# Altium schematic sheet IF_TX.SchDoc: {Наименование}
size 420 x 297 mm; DocumentNumber: ПЛАС.ХХХХХХ.ХХХ ХХ; SheetNumber: {}; SheetTotal: {}; PageSetup: Record=PageOptions|CenterHorizontal=False|CenterVertical=False|PrintScale=0.95|XCorrection=0.00|YCorrection=0.00|PrintKind=1|BorderSize=5000000|LeftOffset=0|BottomOffset=0|Orientation=1|PaperLength=1000|PaperWidth=1000|Scale=100|PaperSource=15|PrintQuality=600|MediaType=1|DitherType=10|PaperKind=A4|PrintScaleMode=1; Rule: PcbType=ProtelPcb
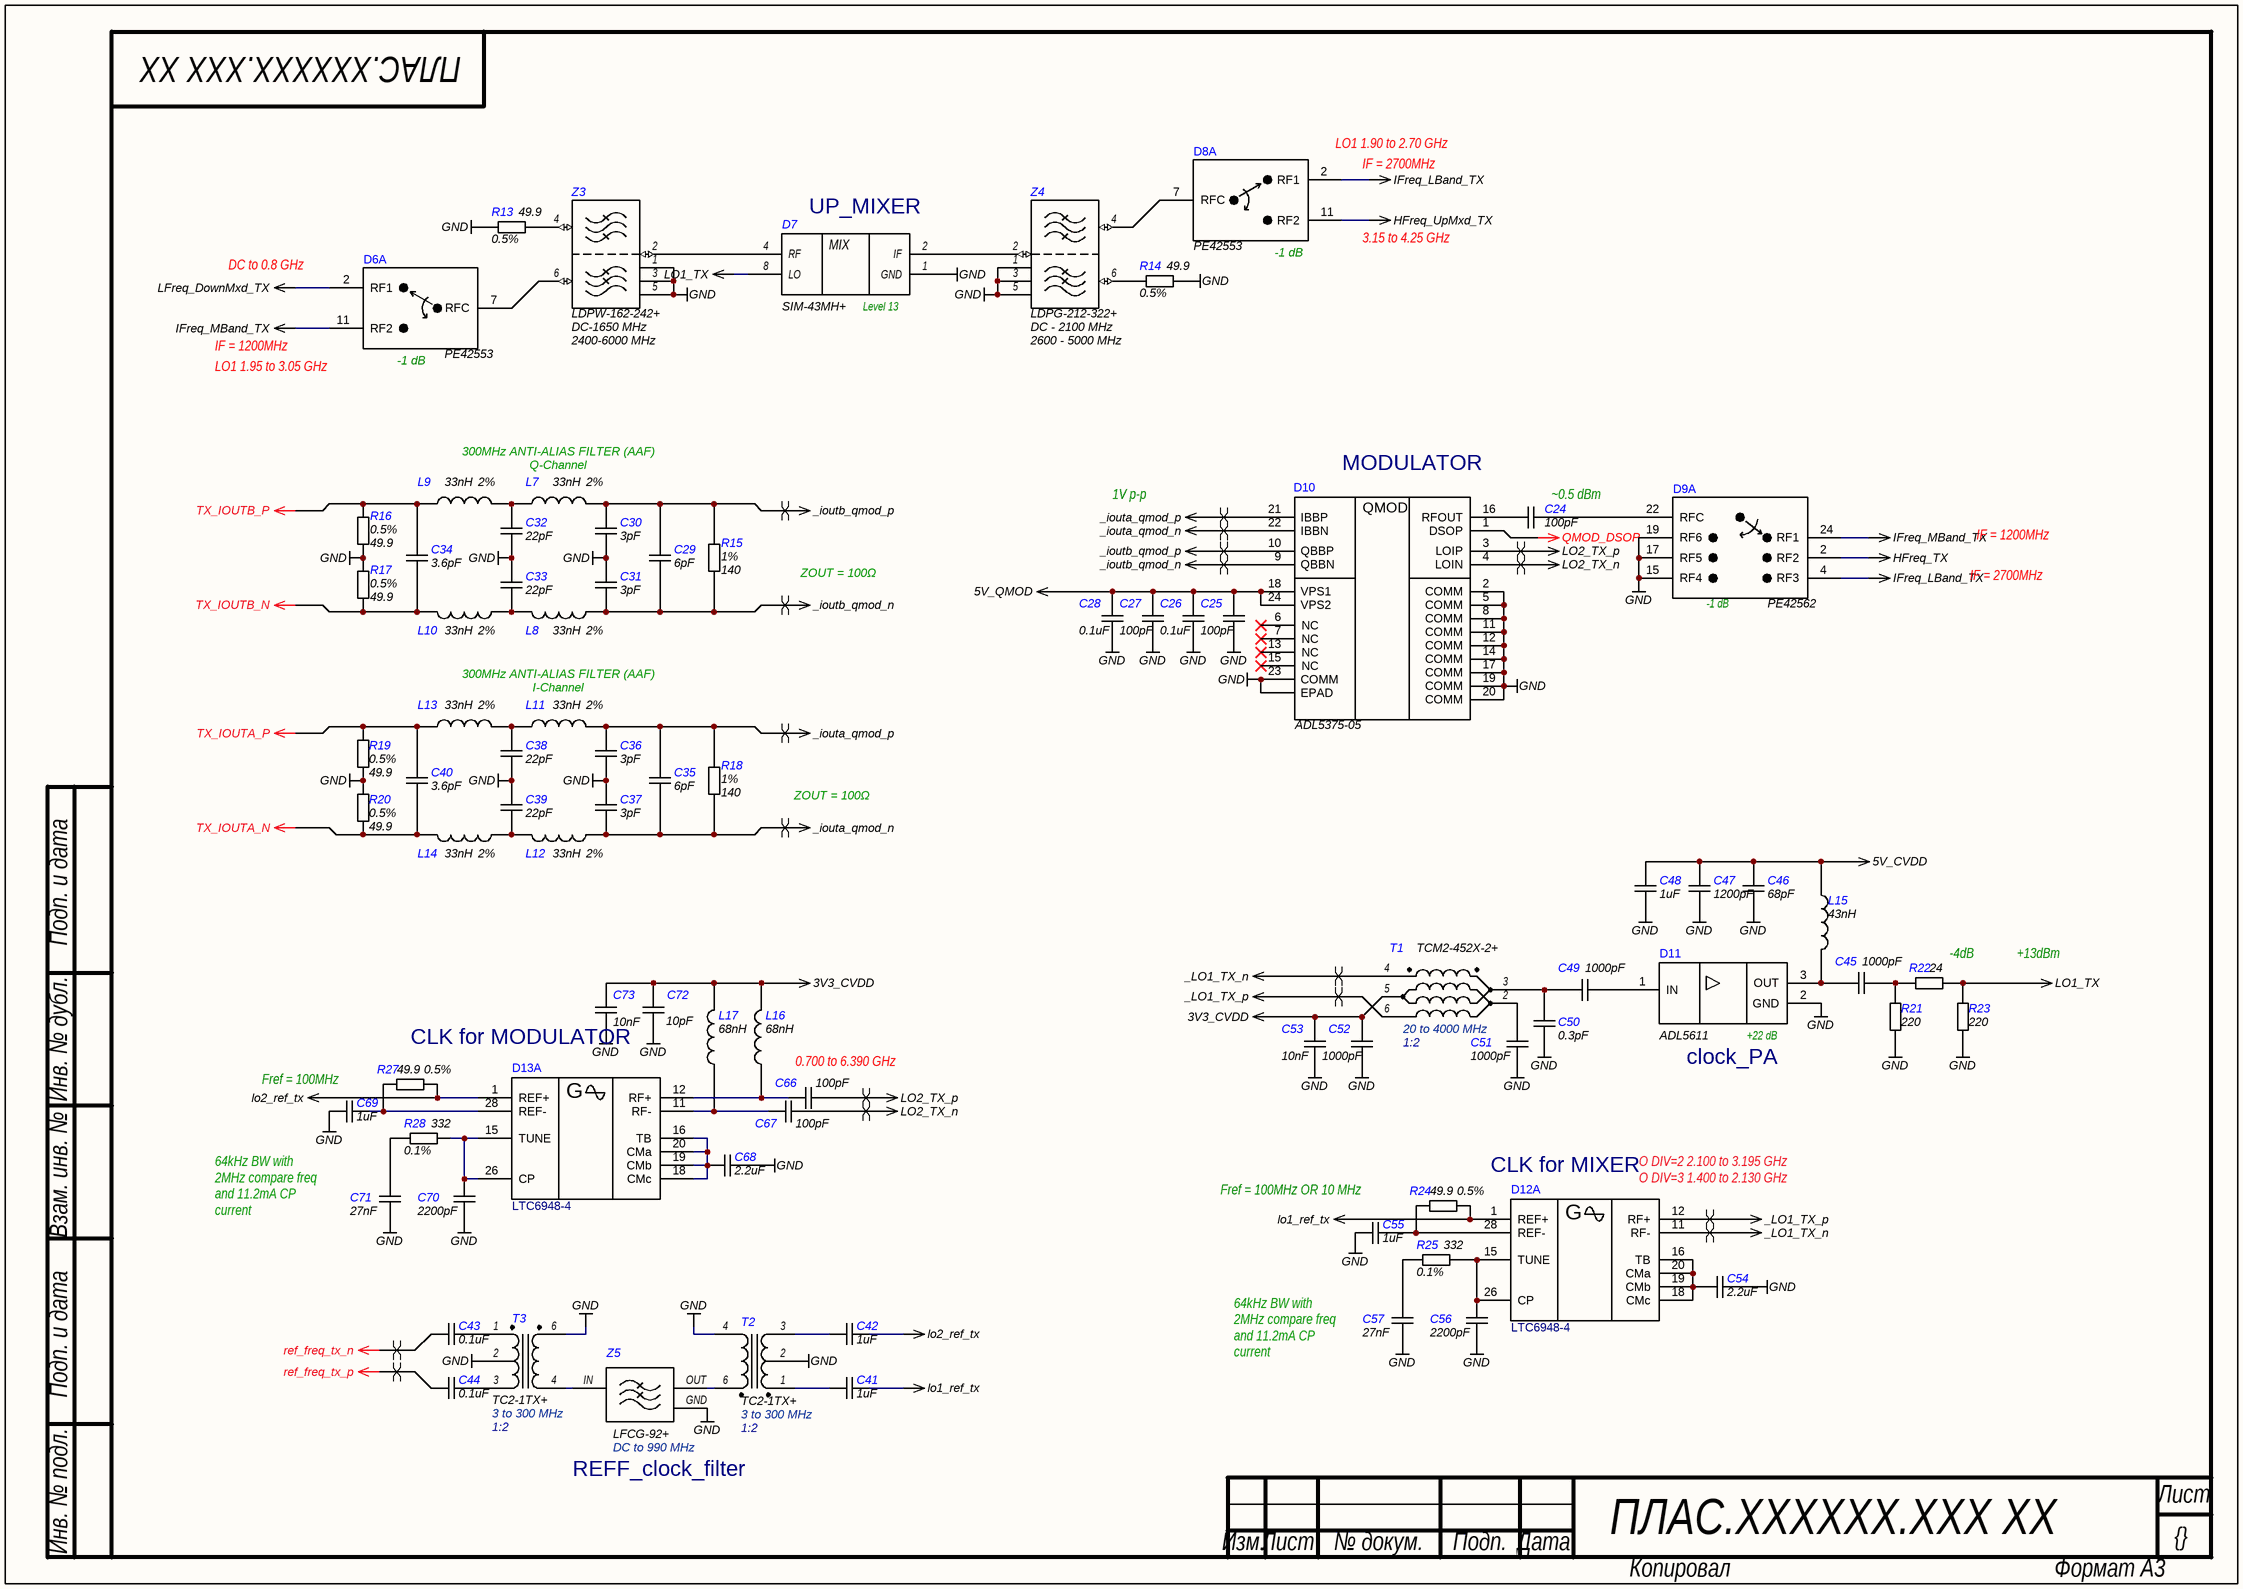
[diagram p0: IF_TX.SchDoc]

## Parts
C24  value 100pF  [C0402]  (hidden comment: CAP)
C25  value 100pF  [C0402]  (hidden comment: CAP)
C26  value 0.1uF  [C0402]  (hidden comment: CAP)
C27  value 100pF  [C0402]  (hidden comment: CAP)
C28  value 0.1uF  [C0402]  (hidden comment: CAP)
C29  value 6pF  [C0402]  (hidden comment: CAP)
C30  value 3pF  [C0402]  (hidden comment: CAP)
C31  value 3pF  [C0402]  (hidden comment: CAP)
C32  value 22pF  [C0402]  (hidden comment: CAP)
C33  value 22pF  [C0402]  (hidden comment: CAP)
C34  value 3.6pF  [C0402]  (hidden comment: CAP)
C35  value 6pF  [C0402]  (hidden comment: CAP)
C36  value 3pF  [C0402]  (hidden comment: CAP)
C37  value 3pF  [C0402]  (hidden comment: CAP)
C38  value 22pF  [C0402]  (hidden comment: CAP)
C39  value 22pF  [C0402]  (hidden comment: CAP)
C40  value 3.6pF  [C0402]  (hidden comment: CAP)
C41  value 1uF  [C0603]  (hidden comment: CAP)
C42  value 1uF  [C0603]  (hidden comment: CAP)
C43  value 0.1uF  [C0402]  (hidden comment: CAP)
C44  value 0.1uF  [C0402]  (hidden comment: CAP)
C45  value 1000pF  [C0402]  (hidden comment: CAP)
C46  value 68pF  [C0402]  (hidden comment: CAP)
C47  value 1200pF  [C0603]  (hidden comment: CAP)
C48  value 1uF  [C0603]  (hidden comment: CAP)
C49  value 1000pF  [C0402]  (hidden comment: CAP)
C50  value 0.3pF  [C0402]  (hidden comment: CAP)
C51  value 1000pF  [C0402]  (hidden comment: CAP)
C52  value 1000pF  [C0402]  (hidden comment: CAP)
C53  value 10nF  [C0402]  (hidden comment: CAP)
C54  value 2.2uF  [C0603]  (hidden comment: CAP)
C55  value 1uF  [C0603]  (hidden comment: CAP)
C56  value 2200pF  [C0603]  (hidden comment: CAP)
C57  value 27nF  [C0603]  (hidden comment: CAP)
C66  value 100pF  [C0402]  (hidden comment: CAP)
C67  value 100pF  [C0402]  (hidden comment: CAP)
C68  value 2.2uF  [C0603]  (hidden comment: CAP)
C69  value 1uF  [C0603]  (hidden comment: CAP)
C70  value 2200pF  [C0603]  (hidden comment: CAP)
C71  value 27nF  [C0603]  (hidden comment: CAP)
C72  value 10pF  [C0402]  (hidden comment: CAP)
C73  value 10nF  [C0402]  (hidden comment: CAP)
D6  PE42553  [QFN-16]  (part A of 2)
D7  SIM-43MH+  [SIM-43MH+]
D8  PE42553  [QFN-16]  (part A of 2)
D9  PE42562  [QFN-24]  (part A of 2)
D10  Name: ADL5375-05  [LFCSP-24]  (hidden comment: ADL5375)
D11  ADL5611  [ADL5610]
D12  LTC6948-4  [QFN-28]  (part A of 2)
D13  LTC6948-4  [QFN-28]  (part A of 2)
L7  value 33nH  Tolerance: 2%  [L0603_HP]  (hidden comment: Inductor RF)
L8  value 33nH  Tolerance: 2%  [L0603_HP]  (hidden comment: Inductor RF)
L9  value 33nH  Tolerance: 2%  [L0603_HP]  (hidden comment: Inductor RF)
L10  value 33nH  Tolerance: 2%  [L0603_HP]  (hidden comment: Inductor RF)
L11  value 33nH  Tolerance: 2%  [L0603_HP]  (hidden comment: Inductor RF)
L12  value 33nH  Tolerance: 2%  [L0603_HP]  (hidden comment: Inductor RF)
L13  value 33nH  Tolerance: 2%  [L0603_HP]  (hidden comment: Inductor RF)
L14  value 33nH  Tolerance: 2%  [L0603_HP]  (hidden comment: Inductor RF)
L15  value 43nH  [L0603_HP]  (hidden comment: Inductor RF)
L16  value 68nH  [L0603_HP]  (hidden comment: Inductor RF)
L17  value 68nH  [L0603_HP]  (hidden comment: Inductor RF)
R13  value 49.9  Tolerance: 0.5%  [R0402]  (hidden comment: RES)
R14  value 49.9  Tolerance: 0.5%  [R0402]  (hidden comment: RES)
R15  value 140  Tolerance: 1%  [R0402]  (hidden comment: RES)
R16  value 49.9  Tolerance: 0.5%  [R0402]  (hidden comment: RES)
R17  value 49.9  Tolerance: 0.5%  [R0402]  (hidden comment: RES)
R18  value 140  Tolerance: 1%  [R0402]  (hidden comment: RES)
R19  value 49.9  Tolerance: 0.5%  [R0402]  (hidden comment: RES)
R20  value 49.9  Tolerance: 0.5%  [R0402]  (hidden comment: RES)
R21  value 220  [R0402]  (hidden comment: RES)
R22  value 24  [R0402]  (hidden comment: RES)
R23  value 220  [R0402]  (hidden comment: RES)
R24  value 49.9  Tolerance: 0.5%  [R0402]  (hidden comment: RES)
R25  value 332  Tolerance: 0.1%  [R0603]  (hidden comment: RES)
R27  value 49.9  Tolerance: 0.5%  [R0402]  (hidden comment: RES)
R28  value 332  Tolerance: 0.1%  [R0603]  (hidden comment: RES)
T1  TCM2-452X-2+  Frequency: 20 to 4000 MHz  Ratio: 1:2  [DB1627]
T2  TC2-1TX+  Frequency: 3 to 300 MHz  Ratio: 1:2  [AT1521]
T3  TC2-1TX+  Frequency: 3 to 300 MHz  Ratio: 1:2  [AT1521]
Z3  LDPW-162-242+  Low Pass: DC-1650 MHz  High Pass: 2400-6000 MHz  [JC0603C]
Z4  LDPG-212-322+  Low Pass: DC - 2100 MHz  High Pass: 2600 - 5000 MHz  [GE0805C-10]
Z5  LFCG-92+  Frequency: DC to 990 MHz  [GE0805C-2]

## Nets
3V3_CVDD: C52.1 C53.2 C72.2 C73.2 L16.2 L17.2 T1.5
5V_CVDD: C46.2 C47.2 C48.1 L15.2
5V_QMOD: C25.2 C26.2 C27.2 C28.2 D10.18(VPS1) D10.24(VPS2)
_iouta_qmod_n: C35.2 C37.2 D10.22(IBBN) L12.2 R18.2
_iouta_qmod_p: C35.1 C36.1 D10.21(IBBP) L11.2 R18.1
_ioutb_qmod_n: C29.2 C31.2 D10.9(QBBN) L8.2 R15.2
_ioutb_qmod_p: C29.1 C30.1 D10.10(QBBP) L7.2 R15.1
_LO1_TX_n: D12.11(RF-) T1.4
_LO1_TX_p: D12.12(RF+) T1.6
GND: C25.1 C26.1 C27.1 C28.1 C30.2 C31.1 C32.2 C33.1 C36.2 C37.1 C38.2 C39.1 C46.1 C47.1 C48.2 C50.1 C51.2 C52.2 C53.1 C54.1 C55.2 C56.1 C57.1 C68.1 C69.2 C70.1 C71.1 C72.1 C73.1 D7.1(GND) D9.15(RF4) D9.17(RF5) D9.19(RF6) D10.2(COMM) D10.5(COMM) D10.8(COMM) D10.11(COMM) D10.12(COMM) D10.14(COMM) D10.17(COMM) D10.19(COMM) D10.20(COMM) D10.23(COMM) D10.25(EPAD) D11.2(GND) R13.1 R14.1 R16.2 R17.1 R19.2 R20.1 R21.2 R23.2 T2.2 T2.4 T3.2 T3.6 Z3.1(GND) Z3.3(GND) Z3.5(GND) Z4.1(GND) Z4.3(GND) Z4.5(GND) Z5.GND
HFreq_TX: D9.2(RF2)
HFreq_UpMxd_TX: D8.11(RF2)
IFreq_LBand_TX: D8.2(RF1) D9.4(RF3)
IFreq_MBand_TX: D6.11(RF2) D9.24(RF1)
LFreq_DownMxd_TX: D6.2(RF1)
lo1_ref_tx: C41.1 D12.1(REF+) R24.1
LO1_TX: D7.8(LO) R22.1 R23.1
lo2_ref_tx: C42.1 D13.1(REF+) R27.1
LO2_TX_n: C67.2 D10.4(LOIN)
LO2_TX_p: C66.2 D10.3(LOIP)
QMOD_DSOP: D10.1(DSOP)
ref_freq_tx_n: C43.2
ref_freq_tx_p: C44.2
TX_IOUTA_N: C40.2 L14.1 R20.2
TX_IOUTA_P: C40.1 L13.1 R19.1
TX_IOUTB_N: C34.2 L10.1 R17.2
TX_IOUTB_P: C34.1 L9.1 R16.1
NetC24_1: C24.1 D10.16(RFOUT)
NetC24_2: C24.2 D9.22(RFC)
NetC32_1: C32.1 L7.1 L9.2
NetC33_2: C33.2 L8.1 L10.2
NetC38_1: C38.1 L11.1 L13.2
NetC39_2: C39.2 L12.1 L14.2
NetC41_2: C41.2 T2.1
NetC42_2: C42.2 T2.3
NetC43_1: C43.1 T3.1
NetC44_1: C44.1 T3.3
NetC45_1: C45.1 D11.3(OUT) L15.1
NetC45_2: C45.2 R21.1 R22.2
NetC49_1: C49.1 C50.2 T1.3
NetC49_2: C49.2 D11.1(IN)
NetC51_1: C51.1 T1.2
NetC54_2: C54.2 D12.16(TB) D12.18(CMc) D12.19(CMb) D12.20(CMa)
NetC55_1: C55.1 D12.28(REF-) R24.2
NetC56_2: C56.2 D12.15(TUNE) D12.26(CP) R25.1
NetC57_2: C57.2 R25.2
NetC66_1: C66.1 D13.12(RF+) L16.1
NetC67_1: C67.1 D13.11(RF-) L17.1
NetC68_2: C68.2 D13.16(TB) D13.18(CMc) D13.19(CMb) D13.20(CMa)
NetC69_1: C69.1 D13.28(REF-) R27.2
NetC70_2: C70.2 D13.15(TUNE) D13.26(CP) R28.1
NetC71_2: C71.2 R28.2
NetD6_7: D6.7(RFC) Z3.6
NetD7_2: D7.2(IF) Z4.2
NetD7_4: D7.4(RF) Z3.2
NetD8_7: D8.7(RFC) Z4.4
NetR13_2: R13.2 Z3.4
NetR14_2: R14.2 Z4.6
NetT2_6: T2.6 Z5.OUT
NetT3_4: T3.4 Z5.IN

Not connected (* = marked no-connect by the designer): D10 6(NC)* 7(NC)* 13(NC)* 15(NC)*

## Layout directives
differential pair: _iouta_qmod_n, _iouta_qmod_p, _ioutb_qmod_n, _ioutb_qmod_p, _LO1_TX_n, _LO1_TX_p, LO2_TX_n, LO2_TX_p, ref_freq_tx_n, ref_freq_tx_p

## Notes on the sheet
- (near D8) LO1 1.90 to 2.70 GHz
- IF = 2700MHz
- (near D7) UP_MIXER
- 3.15 to 4.25 GHz
- (near D6) DC to 0.8 GHz
- IF = 1200MHz
- (near D6) LO1 1.95 to 3.05 GHz
- 300MHz ANTI-ALIAS FILTER (AAF) Q-Channel
- 1V p-p
- (near D10) MODULATOR
- (near C24) ~0.5 dBm
- ZOUT = 100Ω
- 300MHz ANTI-ALIAS FILTER (AAF) I-Channel
- (near R22) -4dB
- +13dBm
- (near C73) CLK for MODULATOR
- 0.700 to 6.390 GHz
- (near D11) clock_PA
- (near C69) Fref = 100MHz
- Fref = 100MHz OR 10 MHz
- CLK for MIXER
- (near D12) O DIV=2 2.100 to 3.195 GHz
  O DIV=3 1.400 to 2.130 GHz
- 64kHz BW with 2MHz compare freq and 11.2mA CP current
- REFF_clock_filter
- Подп. и дата
- Инв. № дубл.
- Взам. инв. №
- Инв. № подл.
- Лист
- Изм.
- № докум.
- Подп.
- Дата
- Копировал
- Формат А3
- (in symbol ADL5375) QMOD
- (in symbol ADL5611) +22 dB
- (in symbol LTC6948, part A) G
- (in symbol PE42553, part A) -1 dB
- (in symbol PE42562, part A) -1 dB
- (in symbol SIM-43MH+) MIX; Level 13

## Library data of the parts
C24 C25 C27 C66 C67 = CAP: SMD Capacitor; Manufacturer: Murata; Material: NP0; Tolerance: 1%; Voltage: 50V; Type: Ceramic Capacitor; P/N: GRM1555C1H101FA01D; Supplier 1: Digi-key; Supplier Part Number 1: 490-8180-1-ND; Supplier 2: Mouser; Supplier Part Number 2: 81-GRM1555C1H101FA1D; Supplier 3: Farnell; Supplier Part Number 3: *
C26 C28 C43 C44 = CAP: SMD Capacitor; Manufacturer: Murata; Material: X7R; Tolerance: 10%; Voltage: 10V; Type: Ceramic Capacitor; P/N: GRM155R71A104KA01J; Supplier 1: Digi-key; Supplier Part Number 1: 490-6322-1-ND; Supplier 2: Mouser; Supplier Part Number 2: 81-GRM155R71A104KA1J; Supplier 3: Farnell; Supplier Part Number 3: *
C29 C35 = CAP: SMD Capacitor; Manufacturer: Murata; Material: NP0; Tolerance: ±0.5pF; Voltage: 50V; Type: Ceramic Capacitor; P/N: GRM1555C1H6R0DA01D; Supplier 1: Digi-key; Supplier Part Number 1: 490-5877-1-ND; Supplier 2: Mouser; Supplier Part Number 2: 81-GRM1555C1H6R0DA1D; Supplier 3: Farnell; Supplier Part Number 3: *
C30 C31 C36 C37 = CAP: SMD Capacitor; Manufacturer: Murata; Material: NP0; Tolerance: ±0.25pF; Voltage: 50V; Type: Ceramic Capacitor; P/N: GRM1555C1H3R0CA01D; Supplier 1: Digi-key; Supplier Part Number 1: 490-5872-1-ND; Supplier 2: Mouser; Supplier Part Number 2: 81-GRM1555C1H3R0CA1D; Supplier 3: Farnell; Supplier Part Number 3: *
C32 C33 C38 C39 = CAP: SMD Capacitor; Manufacturer: Murata; Material: NP0; Tolerance: 1%; Voltage: 50V; Type: Ceramic Capacitor; P/N: GRM1555C1H220FA01D; Supplier 1: Digi-key; Supplier Part Number 1: 490-8589-1-ND; Supplier 2: Mouser; Supplier Part Number 2: 81-GRM1555C1H220FA1D; Supplier 3: Farnell; Supplier Part Number 3: *
C34 C40 = CAP: SMD Capacitor; Manufacturer: Murata; Material: NP0; Tolerance: ±0.25pF; Voltage: 50V; Type: Ceramic Capacitor; P/N: GRM1555C1H3R6CA01D; Supplier 1: Digi-key; Supplier Part Number 1: 490-5939-1-ND; Supplier 2: Mouser; Supplier Part Number 2: 81-GRM1555C1H3R6CA1D; Supplier 3: Farnell; Supplier Part Number 3: *
C41 C42 C48 C55 C69 = CAP: SMD Capacitor; Manufacturer: Kemet; Material: X7R; Tolerance: 10%; Voltage: 16V; Type: Ceramic Capacitor; P/N: C0603C105K4RACTU; Supplier 1: Digi-key; Supplier Part Number 1: 399-C0603C105K4RAC7867CT-ND; Supplier 2: Mouser; Supplier Part Number 2: 80-C0603C105K4R; Supplier 3: Farnell; Supplier Part Number 3: *
C45 C49 C51 C52 = CAP: SMD Capacitor; Manufacturer: Murata; Material: NP0; Tolerance: 5%; Voltage: 50V; Type: Ceramic Capacitor; P/N: GRM1555C1H102JA01D; Supplier 1: Digi-key; Supplier Part Number 1: 490-3244-1-ND; Supplier 2: Mouser; Supplier Part Number 2: 81-GRM1555C1H102JA1D; Supplier 3: Farnell; Supplier Part Number 3: *
C46 = CAP: SMD Capacitor; Manufacturer: Murata; Material: NP0; Tolerance: ±1%; Voltage: 50V; Type: Ceramic Capacitor; P/N: GRM1555C1H680FA01D; Supplier 1: Digi-key; Supplier Part Number 1: 490-8219-1-ND; Supplier 2: Mouser; Supplier Part Number 2: 81-GRM1555C1H680FA1D; Supplier 3: Farnell; Supplier Part Number 3: *
C47 = CAP: SMD Capacitor; Manufacturer: Murata; Material: NP0; Tolerance: ±5%; Voltage: 50V; Type: Ceramic Capacitor; P/N: GRM1885C1H122JA01D; Supplier 1: Digi-key; Supplier Part Number 1: 490-1453-1-ND; Supplier 2: Mouser; Supplier Part Number 2: 81-GRM1885C1H122JA01; Supplier 3: Farnell; Supplier Part Number 3: *
C50 = CAP: SMD Capacitor; Manufacturer: Murata; Material: NP0; Tolerance: ±0.05pF; Voltage: 50V; Type: Ceramic Capacitor; P/N: GRM1555C1HR30WA01D; Supplier 1: Digi-key; Supplier Part Number 1: 490-6261-1-ND; Supplier 2: Mouser; Supplier Part Number 2: 81-GRM1555C1HR30WA1D; Supplier 3: Farnell; Supplier Part Number 3: *
C53 C73 = CAP: SMD Capacitor; Manufacturer: Murata; Material: X7R; Tolerance: 10%; Voltage: 25V; Type: Ceramic Capacitor; P/N: GRM155R71E103KA01D; Supplier 1: Digi-key; Supplier Part Number 1: 490-1312-1-ND; Supplier 2: Mouser; Supplier Part Number 2: 81-GRM36X103K25; Supplier 3: Farnell; Supplier Part Number 3: *
C54 C68 = CAP: SMD Capacitor; Manufacturer: Murata; Material: X7R; Tolerance: 10%; Voltage: 10V; Type: Ceramic Capacitor; P/N: GRM188R71A225KE15J; Supplier 1: Digi-key; Supplier Part Number 1: 490-6418-1-ND; Supplier 2: Mouser; Supplier Part Number 2: 81-GRM188R71A225KE5J; Supplier 3: Farnell; Supplier Part Number 3: *
C56 C70 = CAP: SMD Capacitor; Manufacturer: Kemet; Material: NP0; Tolerance: 1%; Voltage: 50V; Type: Ceramic Capacitor; P/N: C0603C222F5GACTU; Supplier 1: Digi-key; Supplier Part Number 1: 399-14502-1-ND; Supplier 2: Mouser; Supplier Part Number 2: 80-C0603C222F5G; Supplier 3: Farnell; Supplier Part Number 3: *
C57 C71 = CAP: SMD Capacitor; Manufacturer: KYOCERA AVX; Material: X7R; Tolerance: ±5%; Voltage: 50V; Type: Ceramic Capacitor; P/N: 06035C273J4Z2A; Supplier 1: Digi-key; Supplier Part Number 1: 478-KAF15AR71H273JTCT-ND; Supplier 2: Mouser; Supplier Part Number 2: 581-06035C273J4Z2A; Supplier 3: Farnell; Supplier Part Number 3: *
C72 = CAP: SMD Capacitor; Manufacturer: Murata; Material: NP0; Tolerance: 1%; Voltage: 50V; Type: Ceramic Capacitor; P/N: GRM1555C1H100FA01D; Supplier 1: Digi-key; Supplier Part Number 1: 490-6186-1-ND; Supplier 2: Mouser; Supplier Part Number 2: 81-GRM1555C1H100FA1D; Supplier 3: Farnell; Supplier Part Number 3: *
D6 D8 = PE42553: HaRPTM technology-enhanced absorptive SPDT; Manufacturer: Peregrine Technical Solutions; P/N: PE42553A-Z; Type: SPDT RF Switch; Name: PE42553; Package: 16-lead 3 × 3 mm QFN; Supplier 1: Digi-Key; Supplier Part Number 1: 1046-1137-1-ND; Supplier 2: Mouser; Supplier Part Number 2: 81-PE42553B-Z; Supplier 3: Farnell; Supplier Part Number 3: *
D7 = SIM-43MH+: Frequency Mixer; Manufacturer: Mini-Circuits; Power Level: +13dBm; Name: SIM-43MH+; Package: HV1195; Type: Frequency Mixer; P/N: SIM-43MH+; Supplier 1: Digi-key; Supplier Part Number 1: *; Supplier 2: Mouser; Supplier Part Number 2: 139-SIM-43MH; Supplier 3: Minicircuits; Supplier Part Number 3: SIM-43MH+
D9 = PE42562: The PE42582 is a HaRP™ technology-enhanced absorptive SP6T RF switch; Manufacturer: Peregrine Technical Solutions; P/N: PE42562A-X; Name: PE42562; Package: 24-lead 4 × 4 × 0.85 mm QFN; Type: Absorptive SP6T RF switch; Supplier 1: Digi-key; Supplier Part Number 1: *; Supplier 2: Mouser; Supplier Part Number 2: 81-PE42562A-X; Supplier 3: Farnell; Supplier Part Number 3: *
D10 = ADL5375: Broadband Quadrature Modulator; Manufacturer: Analog Devices; Voltage: 4.75 V to 5.25 V; P/N: ADL5375-05SCPZEPR7; Package: 24-lead LFCSP_VQ package; Temperature Range: –40°C to 125°C; Type: Broadband Quadrature Modulator; Supplier 1: Digi-key; Supplier Part Number 1: ADL5375-05ACPZ-R7CT-ND; Supplier 2: Mouser; Supplier Part Number 2: 584-ADL5375-05ACPZR7; Supplier 3: Farnell; Supplier Part Number 3: *
D11 = ADL5611: RF/IF Gain Block; Manufacturer: Analog Devices; P/N: ADL5611ARKZ-R7; Name: ADL5611; Package: SOT89; Type: RF/IF Gain Block; Supplier 1: Digi-Key; Supplier Part Number 1: 505-ADL5611ARKZ-R7CT-ND; Supplier 2: Mouser; Supplier Part Number 2: 584-ADL5611ARKZ-R7; Supplier 3: Farnell; Supplier Part Number 3: *
D12 D13 = LTC6948: The LTC®LTC6948 is a high performance, low noise, 6.39GHz  phase-locked loop (PLL); Manufacturer: Linear Technology; Voltage: 3.15 V ~ 5.25 V; Type: Clock/Frequency Synthesizer (RF/IF), Integer N; P/N: LTC6948IUFD-4; Package: 28-QFN (4x5); Temperature Range: -40°C ~ 105°C; Supplier 1: Digi-Key; Supplier Part Number 1: 505-LTC6948IUFD-4#PBF-ND; Name: LTC6948-4; Supplier 2: Mouser; Supplier Part Number 2: 584-LTC6948IUFD-4PBF; Supplier 3: Farnell; Supplier Part Number 3: *
L7-L14 = Inductor RF: Chip SMD Inductor; Manufacturer: Coilcraft; Current: 680mA; Frequency: 2.70GHz; Name: 0603HP-33NXGE; Series: 0603HP; Temperature Range: -25…85°C; P/N: 0603HP-33NXGE; Supplier 1: Digi-key; Supplier Part Number 1: *; Supplier 2: Mouser; Supplier Part Number 2: 994-0603HP-33NXGLW; Supplier 3: Farnell; Supplier Part Number 3: 2286156
L15 = Inductor RF: Chip SMD Inductor; Manufacturer: Coilcraft; Current: 810mA; Frequency: 2.45GHz; Name: 0603HP-43NXJE; Tolerance: 5%; Series: 0603HP; Temperature Range: -25…85°C; P/N: 0603HP-43NXJE; Supplier 1: Digi-key; Supplier Part Number 1: *; Supplier 2: Mouser; Supplier Part Number 2: 994-0603HP-43NXJLW; Supplier 3: Farnell; Supplier Part Number 3: *
L16 L17 = Inductor RF: Chip SMD Inductor; Manufacturer: Coilcraft; Current: 600mA; Frequency: 2.00GHz; Name: 0603HP-68NXJE; Tolerance: 5%; Series: 0603HP; Temperature Range: -25…85°C; P/N: 0603HP-68NXJE; Supplier 1: Digi-key; Supplier Part Number 1: *; Supplier 2: Mouser; Supplier Part Number 2: 994-0603HP-68NXJLW; Supplier 3: Farnell; Supplier Part Number 3: 2286224
R13 R14 R16 R17 R19 R20 R24 R27 = RES: SMD Resistor; Manufacturer: Panasonic Electronic Components; Name: Chip SMD Resistor; Power: 0.063 Wt; P/N: ERJ-2RKD49R9X; Temperature Range: -55…155°C; Supplier 1: Digi-key; Supplier Part Number 1: P15987CT-ND; Supplier 2: Mouser; Supplier Part Number 2: 667-ERJ-2RKD49R9X; Supplier 3: Farnell; Supplier Part Number 3: *
R15 R18 = RES: SMD Resistor; Manufacturer: Panasonic Electronic Components; Name: Chip SMD Resistor; Power: 0.1 Wt; P/N: ERJ-2RKF1400X; Temperature Range: -55…155°C; Supplier 1: Digi-key; Supplier Part Number 1: P140LCT-ND; Supplier 2: Mouser; Supplier Part Number 2: 667-ERJ-2RKF1400X; Supplier 3: Farnell; Supplier Part Number 3: *
R21 R23 = RES: SMD Resistor; Manufacturer: Panasonic Electronic Components; Name: Chip SMD Resistor; Power: 0.1 Wt; Tolerance: ±1%; P/N: ERJ-2RKF2200X; Temperature Range: -55…155°C; Supplier 1: Digi-key; Supplier Part Number 1: *; Supplier 2: Mouser; Supplier Part Number 2: 667-ERJ-2RKF2200X; Supplier 3: Farnell; Supplier Part Number 3: 2302563
R22 = RES: SMD Resistor; Manufacturer: Vishay; Name: Chip SMD Resistor; Power: 0.063 Wt; Tolerance: ±1%; P/N: CRCW040224R0FKED; Temperature Range: -55…155°C; Supplier 1: Digi-key; Supplier Part Number 1: 541-24.0LCT-ND; Supplier 2: Mouser; Supplier Part Number 2: 71-CRCW040224R0FKED; Supplier 3: Farnell; Supplier Part Number 3: *
R25 R28 = RES: SMD Resistor; Manufacturer: Panasonic Electronic Components; Name: Chip SMD Resistor; Power: 0.1 Wt; P/N: ERA-3AEB3320V; Temperature Range: -55…155°C; Supplier 1: Digi-key; Supplier Part Number 1: P332DBCT-ND; Supplier 2: Mouser; Supplier Part Number 2: 667-ERA-3AEB3320V; Supplier 3: Farnell; Supplier Part Number 3: *
T1 = TCM2-452X-2+: RF Transformer; Manufacturer: Mini-Circuits; Name: TCM2-452X-2+; P/N: TCM2-452X-2+; Type: RF Transformer; Package: DB1627; Supplier 1: Digi-key; Supplier Part Number 1: *; Supplier 2: Mouser; Supplier Part Number 2: *; Supplier 3: Minicircuits; Supplier Part Number 3: TCM2-452X-2+
T2 T3 = TC2-1TX+: RF Transformer; Manufacturer: Mini-Circuits; Name: TC2-1TX+; P/N: TC2-1TX+; Type: RF Transformer; Package: AT1521; Supplier 1: Digi-key; Supplier Part Number 1: 3157-TC2-1TX+CT-ND; Supplier 2: Mouser; Supplier Part Number 2: 139-TC2-1TX; Supplier 3: Farnell; Supplier Part Number 3: *
Z3 = LDPW-162-242+: Diplexer; Manufacturer: Mini-Circuits; Frequency: DC to 6000 MHz; Name: LDPW-162-242+; P/N: LDPW-162-242+; Type: Diplexer; Package: JC0603C; Supplier 1: Digi-key; Supplier Part Number 1: 3157-LDPW-162-242+CT-ND; Supplier 2: Mouser; Supplier Part Number 2: 139-LDPW-162-242; Supplier 3: Farnell; Supplier Part Number 3: *
Z4 = LDPG-212-322+: Diplexer; Manufacturer: Mini-Circuits; Frequency: DC to 5000 MHz; Name: LDPG-212-322+; P/N: LDPG-212-322+; Type: Diplexer; Package: GE0805C-10; Supplier 1: Digi-key; Supplier Part Number 1: *; Supplier 2: Mouser; Supplier Part Number 2: *; Supplier 3: Minicircuits; Supplier Part Number 3: LDPG-212-322+
Z5 = LFCG-92+: Low Pass Filter; Manufacturer: Mini-Circuits; Name: LFCG-92+; P/N: LFCG-92+; Type: Low Pass Filter; Package: GE0805C-2; Supplier 1: Digi-key; Supplier Part Number 1: 3157-LFCG-92+CT-ND; Supplier 2: Mouser; Supplier Part Number 2: 139-LFCG-92; Supplier 3: Farnell; Supplier Part Number 3: *